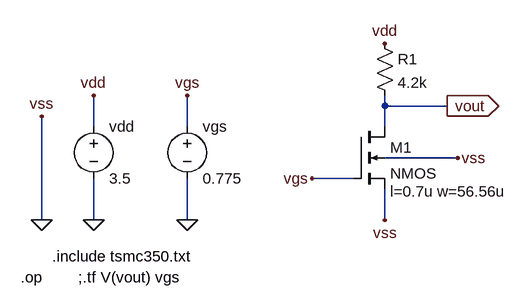
[diagram p0: schematic CS_amplifier360.asc]
CS_amplifier360.asc, the LTspice schematic file:
Version 4
SHEET 1 880 680
WIRE 320 96 320 80
WIRE 416 96 320 96
WIRE -128 128 -128 80
WIRE 16 128 16 80
WIRE 320 128 320 96
WIRE 432 176 320 176
WIRE 272 208 208 208
WIRE -208 272 -208 112
WIRE -128 272 -128 208
WIRE 16 272 16 208
WIRE 320 272 320 224
FLAG 16 272 0
FLAG -128 272 0
FLAG -208 272 0
FLAG -208 112 vss
FLAG 16 80 vgs
FLAG 320 272 vss
FLAG 432 176 vss
FLAG 208 208 vgs
FLAG -128 80 vdd
FLAG 320 0 vdd
FLAG 416 96 vout
IOPIN 416 96 Out
SYMBOL nmos4 272 128 R0
WINDOW 123 56 100 Left 2
SYMATTR Value2 l=0.7u w=56.56u
SYMATTR InstName M1
SYMBOL voltage 16 112 R0
WINDOW 123 0 0 Left 0
WINDOW 39 0 0 Left 0
SYMATTR InstName vgs
SYMATTR Value 0.775
SYMBOL voltage -128 112 R0
WINDOW 123 0 0 Left 0
WINDOW 39 0 0 Left 0
SYMATTR InstName vdd
SYMATTR Value 3.5
SYMBOL res 304 -16 R0
SYMATTR InstName R1
SYMATTR Value 4.2k
TEXT -192 328 Left 2 !.include tsmc350.txt
TEXT -240 360 Left 2 !.op
TEXT -152 360 Left 2 !;.tf V(vout) vgs

The netlist it stands for:
* CS_amplifier360.asc
M1 vout vgs 0 0 NMOS l=0.7u w=56.56u
vgs vgs 0 0.775
vdd vdd 0 3.5
R1 vdd vout 4.2k
.model NMOS NMOS
.model PMOS PMOS
.lib standard.mos
.include tsmc350.txt
.op
;.tf V(vout) vgs
.backanno
.end